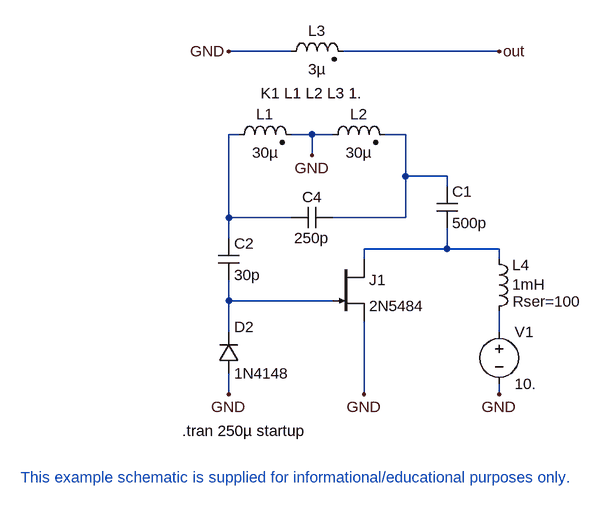
[diagram p0: schematic Hartly.asc]
Hartly.asc, the LTspice schematic file:
Version 4
SHEET 1 2624 2336
WIRE 1984 2048 2144 2048
WIRE 2400 2064 2400 2096
WIRE 2400 2176 2400 2192
WIRE 2192 1984 2192 1968
WIRE 2192 1968 2320 1968
WIRE 2400 1984 2400 1968
WIRE 2080 1920 1984 1920
WIRE 1984 1920 1984 1792
WIRE 1984 1792 2000 1792
WIRE 2080 1792 2112 1792
WIRE 2224 1792 2256 1792
WIRE 2320 1936 2320 1968
WIRE 2320 1968 2400 1968
WIRE 2144 1920 2256 1920
WIRE 2256 1920 2256 1856
WIRE 2320 1856 2256 1856
WIRE 2256 1856 2256 1792
WIRE 2320 1856 2320 1872
WIRE 2112 1792 2112 1824
WIRE 2112 1792 2144 1792
WIRE 1984 1952 1984 1920
WIRE 1984 2016 1984 2048
WIRE 1984 2096 1984 2048
WIRE 1984 2160 1984 2192
WIRE 2192 2080 2192 2192
WIRE 2160 1664 2400 1664
WIRE 2080 1664 1984 1664
FLAG 2400 2192 GND
FLAG 2192 2192 GND
FLAG 2112 1824 GND
FLAG 1984 2192 GND
FLAG 1984 1664 GND
FLAG 2400 1664 out
SYMBOL njf 2144 1984 R0
SYMATTR InstName J1
SYMATTR Value 2N5484
SYMBOL voltage 2400 2080 R0
SYMATTR InstName V1
SYMATTR Value 10.
SYMBOL cap 2144 1904 R90
WINDOW 0 0 32 VBottom 0
WINDOW 3 32 32 VTop 0
SYMATTR InstName C4
SYMATTR Value 250p
SYMBOL ind 2384 1968 R0
WINDOW 0 36 25 Left 0
WINDOW 3 36 55 Left 0
WINDOW 39 37 81 Left 0
SYMATTR InstName L4
SYMATTR Value 1mH
SYMATTR SpiceLine Rser=100
SYMBOL ind2 2128 1808 R270
WINDOW 0 32 56 VTop 0
WINDOW 3 4 56 VBottom 0
SYMATTR InstName L2
SYMATTR Value 30µ
SYMBOL ind2 1984 1808 R270
WINDOW 0 32 56 VTop 0
WINDOW 3 4 56 VBottom 0
SYMATTR InstName L1
SYMATTR Value 30µ
SYMBOL cap 2304 1872 R0
SYMATTR InstName C1
SYMATTR Value 500p
SYMBOL cap 1968 1952 R0
SYMATTR InstName C2
SYMATTR Value 30p
SYMBOL diode 1968 2160 M180
WINDOW 0 24 72 Left 0
WINDOW 3 24 0 Left 0
SYMATTR InstName D2
SYMATTR Value 1N4148
SYMBOL ind2 2064 1680 R270
WINDOW 0 32 56 VTop 0
WINDOW 3 4 56 VBottom 0
SYMATTR InstName L3
SYMATTR Value 3µ
TEXT 1912 2248 Left 0 !.tran 250µ startup
TEXT 2112 1728 Center 0 !K1 L1 L2 L3 1.
text 1664 2320 Left 0 ;This example schematic is supplied for informational/educational purposes only.

The netlist it stands for:
* Hartly.asc
J1 N003 N001 GND 2N5484
V1 N002 GND 10.
C4 N005 N004 250p
L4 N003 N002 1mH Rser=100
L2 GND N005 30µ
L1 N004 GND 30µ
C1 N005 N003 500p
C2 N004 N001 30p
D2 GND N001 1N4148
L3 GND out 3µ
.model D D
.lib standard.dio
.model NJF NJF
.model PJF PJF
.lib standard.jft
.tran 250µ startup
K1 L1 L2 L3 1.
* This example schematic is supplied for informational/educational purposes only.
.backanno
.end